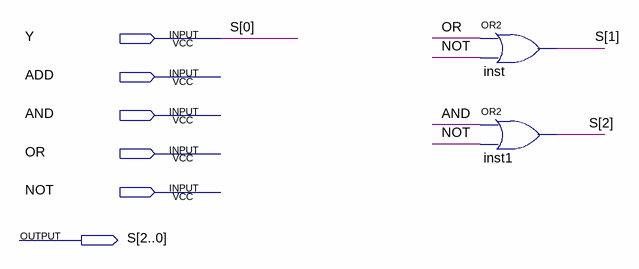
[diagram p0: schematic sheet]
// Quartus schematic ENCOD_ULA.bdf as structural Verilog: 2 symbols, 6 pins
module ENCOD_ULA (
  input  Y,
  input  ADD,
  input  AND,
  input  OR,
  input  NOT,
  output [2:0] S
);

  or inst (S[1], OR, NOT);
  or inst1 (S[2], AND, NOT);

  assign S[0] = Y;
endmodule
